# Altium schematic sheet BatteryController.SchDoc: Battery Management
size A3; ApprovedBy: Self; CheckedBy: Self; CompanyName: TAISAT; DrawnBy: Alperen FENERCİ; Organization: IKA; SheetNumber: 2; SheetTotal: 6
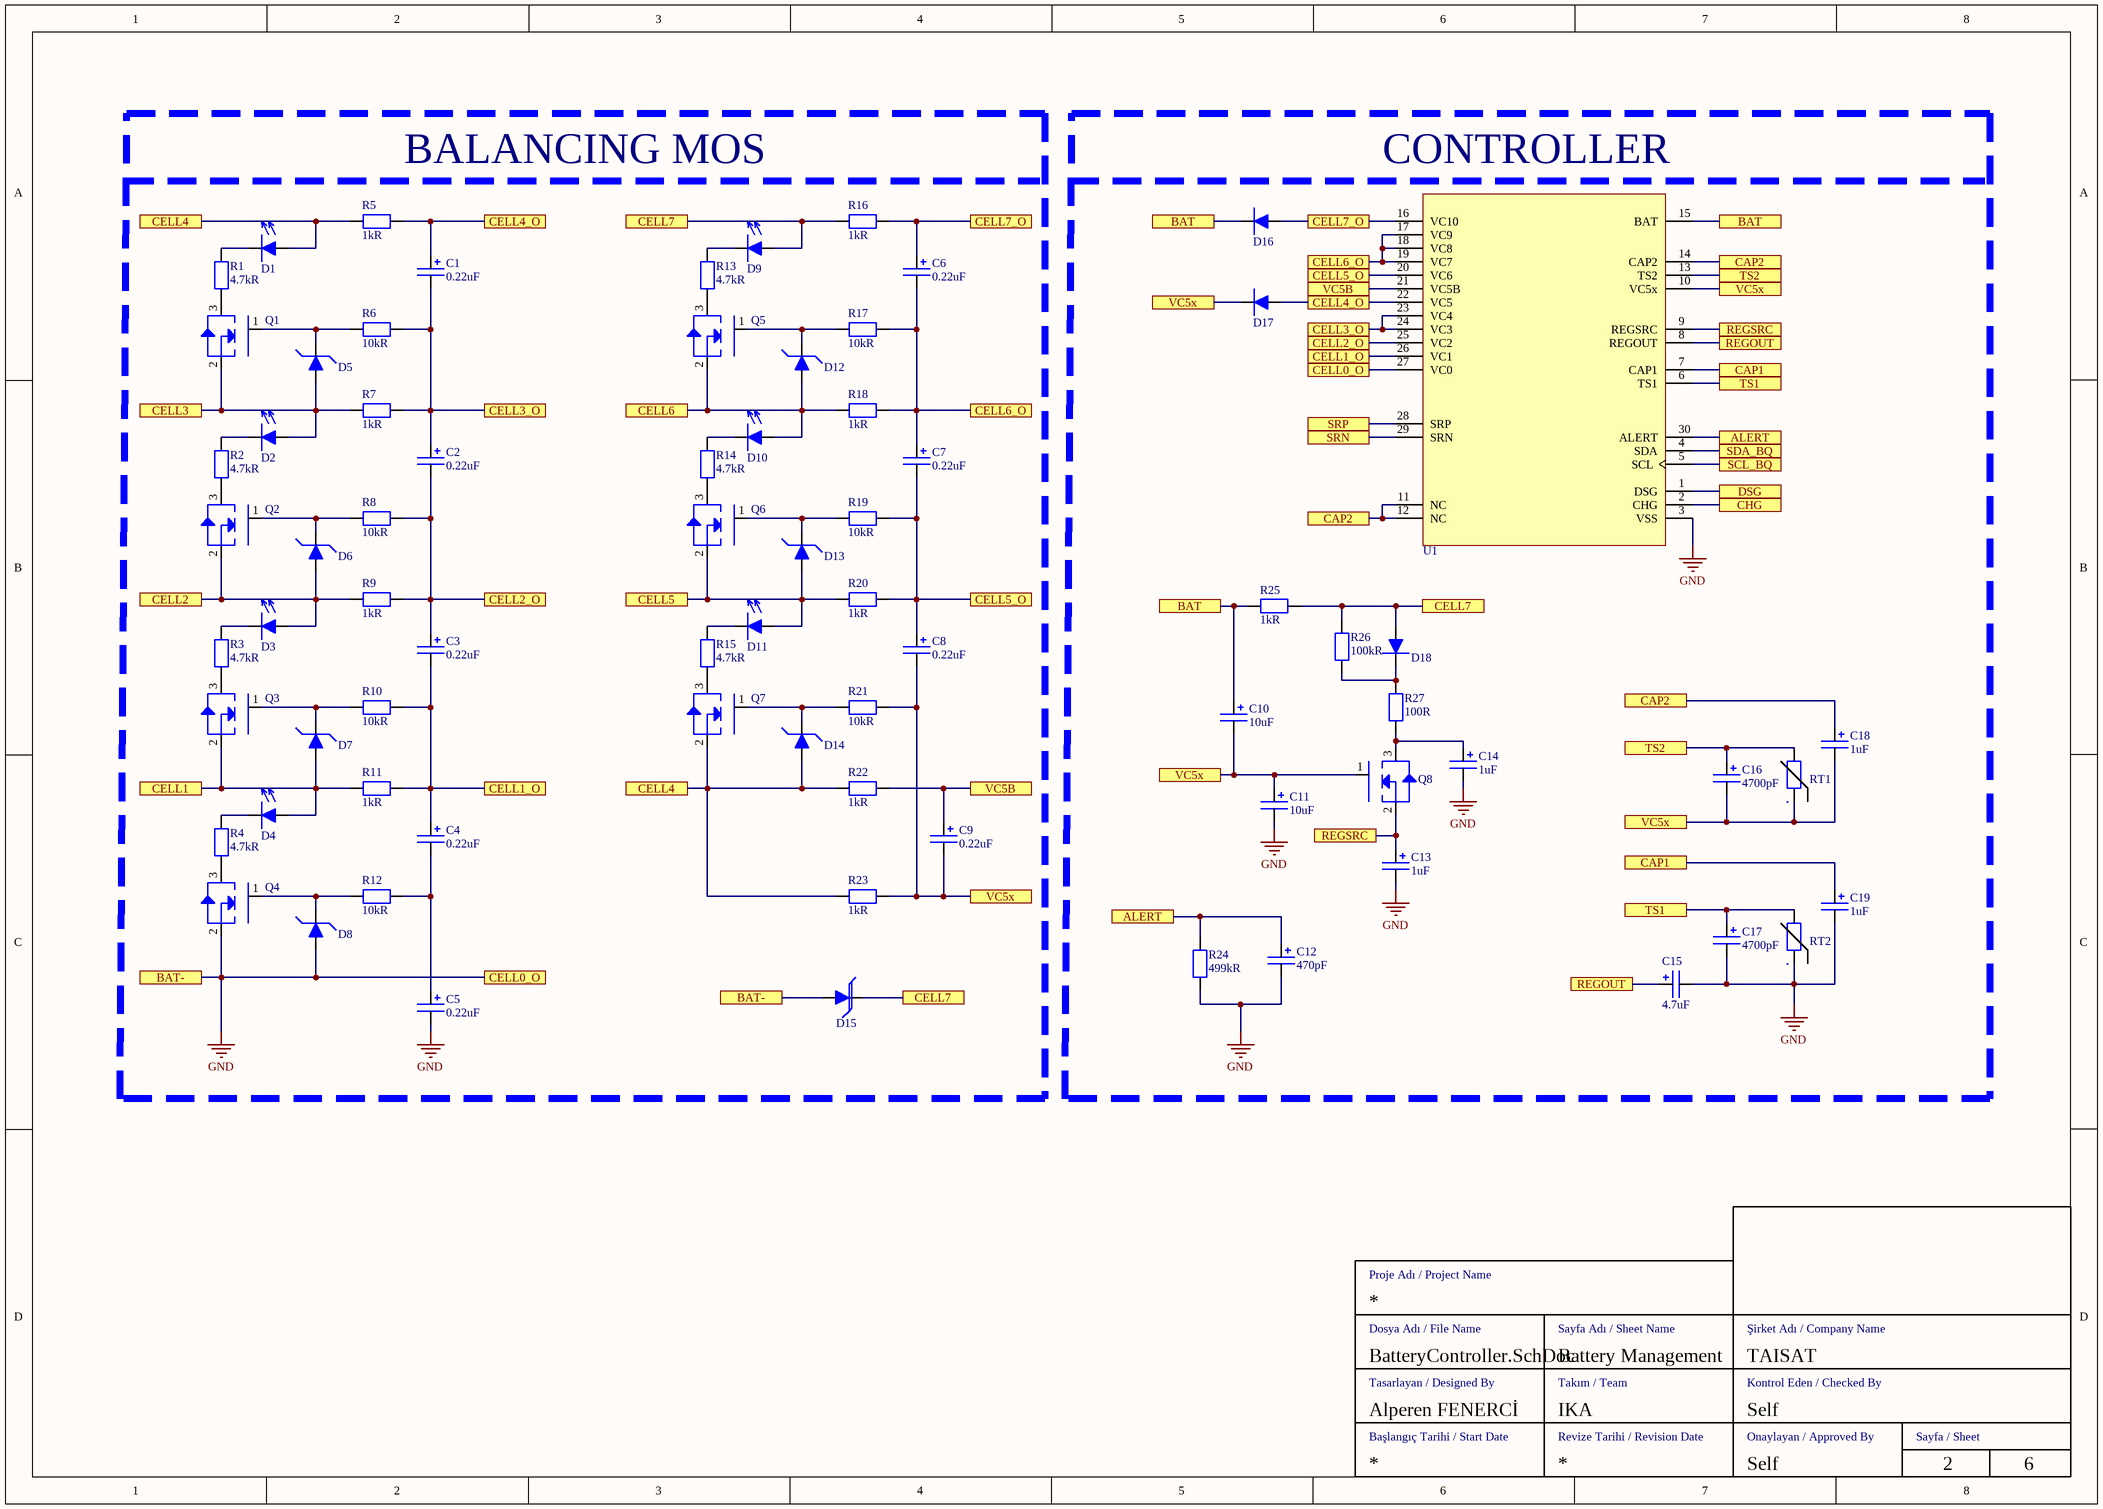
[diagram p0: BatteryController.SchDoc]

## Parts
C1  value 0.22uF  [CAP 0603]  (hidden comment: CAP 0603)
C2  value 0.22uF  [CAP 0603]  (hidden comment: CAP 0603)
C3  value 0.22uF  [CAP 0603]  (hidden comment: CAP 0603)
C4  value 0.22uF  [CAP 0603]  (hidden comment: CAP 0603)
C5  value 0.22uF  [CAP 0603]  (hidden comment: CAP 0603)
C6  value 0.22uF  [CAP 0603]  (hidden comment: CAP 0603)
C7  value 0.22uF  [CAP 0603]  (hidden comment: CAP 0603)
C8  value 0.22uF  [CAP 0603]  (hidden comment: CAP 0603)
C9  value 0.22uF  [CAP 0603]  (hidden comment: CAP 0603)
C10  value 10uF  [CAP 0603]  (hidden comment: CAP 0603)
C11  value 10uF  [CAP 0603]  (hidden comment: CAP 0603)
C12  value 470pF  [CAP 0603]  (hidden comment: CAP 0603)
C13  value 1uF  [CAP 0603]  (hidden comment: CAP 0603)
C14  value 1uF  [CAP 0603]  (hidden comment: CAP 0603)
C15  value 4.7uF  [CAP 0603]  (hidden comment: CAP 0603)
C16  value 4700pF  [CAP 0603]  (hidden comment: CAP 0603)
C17  value 4700pF  [CAP 0603]  (hidden comment: CAP 0603)
C18  value 1uF  [CAP 0603]  (hidden comment: CAP 0603)
C19  value 1uF  [CAP 0603]  (hidden comment: CAP 0603)
D1  LTW-C191TLA  [LED 0603]  (value not drawn)
D2  LTW-C191TLA  [LED 0603]  (value not drawn)
D3  LTW-C191TLA  [LED 0603]  (value not drawn)
D4  LTW-C191TLA  [LED 0603]  (value not drawn)
D5  MM3Z5V1T1G  [SOD323]  (value not drawn)
D6  MM3Z5V1T1G  [SOD323]  (value not drawn)
D7  MM3Z5V1T1G  [SOD323]  (value not drawn)
D8  MM3Z5V1T1G  [SOD323]  (value not drawn)
D9  LTW-C191TLA  [LED 0603]  (value not drawn)
D10  LTW-C191TLA  [LED 0603]  (value not drawn)
D11  LTW-C191TLA  [LED 0603]  (value not drawn)
D12  MM3Z5V1T1G  [SOD323]  (value not drawn)
D13  MM3Z5V1T1G  [SOD323]  (value not drawn)
D14  MM3Z5V1T1G  [SOD323]  (value not drawn)
D15  SMAJ36A-HT  [DO214AC]  (value not drawn)
D16  BAV20W-7-F  [SOD123]  (value not drawn)
D17  BAV20W-7-F  [SOD123]  (value not drawn)
D18  1N4148WS  [SOD323]  (value not drawn)
Q1  2N7002K  [SOT23-3]  (value not drawn)
Q2  2N7002K  [SOT23-3]  (value not drawn)
Q3  2N7002K  [SOT23-3]  (value not drawn)
Q4  2N7002K  [SOT23-3]  (value not drawn)
Q5  2N7002K  [SOT23-3]  (value not drawn)
Q6  2N7002K  [SOT23-3]  (value not drawn)
Q7  2N7002K  [SOT23-3]  (value not drawn)
Q8  2N7002K  [SOT23-3]  (value not drawn)
R1  value 4.7kR  [RESISTOR 1206]  (hidden comment: RES 1206)
R2  value 4.7kR  [RESISTOR 1206]  (hidden comment: RES 1206)
R3  value 4.7kR  [RESISTOR 1206]  (hidden comment: RES 1206)
R4  value 4.7kR  [RESISTOR 1206]  (hidden comment: RES 1206)
R5  value 1kR  [RESISTOR 0603]  (hidden comment: RES 0603)
R6  value 10kR  [RESISTOR 0603]  (hidden comment: RES 0603)
R7  value 1kR  [RESISTOR 0603]  (hidden comment: RES 0603)
R8  value 10kR  [RESISTOR 0603]  (hidden comment: RES 0603)
R9  value 1kR  [RESISTOR 0603]  (hidden comment: RES 0603)
R10  value 10kR  [RESISTOR 0603]  (hidden comment: RES 0603)
R11  value 1kR  [RESISTOR 0603]  (hidden comment: RES 0603)
R12  value 10kR  [RESISTOR 0603]  (hidden comment: RES 0603)
R13  value 4.7kR  [RESISTOR 1206]  (hidden comment: RES 1206)
R14  value 4.7kR  [RESISTOR 1206]  (hidden comment: RES 1206)
R15  value 4.7kR  [RESISTOR 1206]  (hidden comment: RES 1206)
R16  value 1kR  [RESISTOR 0603]  (hidden comment: RES 0603)
R17  value 10kR  [RESISTOR 0603]  (hidden comment: RES 0603)
R18  value 1kR  [RESISTOR 0603]  (hidden comment: RES 0603)
R19  value 10kR  [RESISTOR 0603]  (hidden comment: RES 0603)
R20  value 1kR  [RESISTOR 0603]  (hidden comment: RES 0603)
R21  value 10kR  [RESISTOR 0603]  (hidden comment: RES 0603)
R22  value 1kR  [RESISTOR 0603]  (hidden comment: RES 0603)
R23  value 1kR  [RESISTOR 0603]  (hidden comment: RES 0603)
R24  value 499kR  [RESISTOR 0603]  (hidden comment: RES 0603)
R25  value 1kR  [RESISTOR 0603]  (hidden comment: RES 0603)
R26  value 100kR  [RESISTOR 0603]  (hidden comment: RES 0603)
R27  value 100R  [RESISTOR 0603]  (hidden comment: RES 0603)
RT1  NTC 0603  [NTC 0603]  (value not drawn)
RT2  NTC 0603  [NTC 0603]  (value not drawn)
U1  BQ76930  [TSSOP-30]  (value not drawn)

## Blocks framed on the sheet
BALANCING MOS: C1-C9 D1-D15 Q1-Q7 R1-R23
CONTROLLER: C10-C19 D16-D18 Q8 R24-R27 RT1 RT2 U1

## Ports
ALERT, BAT, BAT-, CAP1, CAP2, CELL0_O, CELL1, CELL1_O, CELL2, CELL2_O, CELL3, CELL3_O, CELL4, CELL4_O, CELL5, CELL5_O, CELL6, CELL6_O, CELL7, CELL7_O, CHG, DSG, REGOUT, REGSRC, SCL_BQ, SDA_BQ, SRN, SRP, TS1, TS2, VC5B, VC5x

## Nets
GND: C5.2 C11.2 C12.2 C13.2 C14.2 C15.2 C17.2 C19.2 D8.2 D15.2 Q4.2(S) R24.1 RT2.1 U1.3(VSS) U1.27(VC0) ; port BAT-, port CELL0_O
ALERT: C12.1 R24.2 U1.30(ALERT) ; port ALERT
BAT: C10.1 D16.1 R25.2 U1.15(BAT) ; port BAT
CAP1: C19.1 U1.7(CAP1) ; port CAP1
CAP2: C18.1 U1.11(NC) U1.12(NC) U1.14(CAP2) ; port CAP2
CELL1: D4.2 D7.2 Q3.2(S) R11.2 ; port CELL1
CELL1_O: C3.2 C4.1 R10.1 R11.1 U1.26(VC1) ; port CELL1_O
CELL2: D3.2 D6.2 Q2.2(S) R9.2 ; port CELL2
CELL2_O: C2.2 C3.1 R8.1 R9.1 U1.25(VC2) ; port CELL2_O
CELL3: D2.2 D5.2 Q1.2(S) R7.2 ; port CELL3
CELL3_O: C1.2 C2.1 R6.1 R7.1 U1.23(VC4) U1.24(VC3) ; port CELL3_O
CELL4: D1.2 D14.2 Q7.2(S) R5.2 R22.2 R23.2 ; port CELL4
CELL4_O: C1.1 D17.2 R5.1 U1.22(VC5) ; port CELL4_O
CELL5: D11.2 D13.2 Q6.2(S) R20.2 ; port CELL5
CELL5_O: C7.2 C8.1 R19.1 R20.1 U1.20(VC6) ; port CELL5_O
CELL6: D10.2 D12.2 Q5.2(S) R18.2 ; port CELL6
CELL6_O: C6.2 C7.1 R17.1 R18.1 U1.17(VC9) U1.18(VC8) U1.19(VC7) ; port CELL6_O
CELL7: D9.2 D15.1 D18.2 R16.2 R25.1 R26.2 ; port CELL7
CELL7_O: C6.1 D16.2 R16.1 U1.16(VC10) ; port CELL7_O
CHG: U1.2(CHG) ; port CHG
DSG: U1.1(DSG) ; port DSG
REGOUT: C15.1 U1.8(REGOUT) ; port REGOUT
REGSRC: C13.1 Q8.2(S) U1.9(REGSRC) ; port REGSRC
SCL_BQ: U1.5(SCL) ; port SCL_BQ
SDA_BQ: U1.4(SDA) ; port SDA_BQ
SRN: U1.29(SRN) ; port SRN
SRP: U1.28(SRP) ; port SRP
TS1: C17.1 RT2.2 U1.6(TS1) ; port TS1
TS2: C16.1 RT1.2 U1.13(TS2) ; port TS2
VC5B: C9.1 R22.1 U1.21(VC5B) ; port VC5B
VC5x: C8.2 C9.2 C10.2 C11.1 C16.2 C18.2 D17.1 Q8.1(G) R21.1 R23.1 RT1.1 U1.10(VC5x) ; port VC5x
NetC4_2: C4.2 C5.1 R12.1
NetC14_1: C14.1 Q8.3(D) R27.1
NetD1_1: D1.1 R1.2
NetD2_1: D2.1 R2.2
NetD3_1: D3.1 R3.2
NetD4_1: D4.1 R4.2
NetD5_1: D5.1 Q1.1(G) R6.2
NetD6_1: D6.1 Q2.1(G) R8.2
NetD7_1: D7.1 Q3.1(G) R10.2
NetD8_1: D8.1 Q4.1(G) R12.2
NetD9_1: D9.1 R13.2
NetD10_1: D10.1 R14.2
NetD11_1: D11.1 R15.2
NetD12_1: D12.1 Q5.1(G) R17.2
NetD13_1: D13.1 Q6.1(G) R19.2
NetD14_1: D14.1 Q7.1(G) R21.2
NetD18_1: D18.1 R26.1 R27.2
NetQ1_3: Q1.3(D) R1.1
NetQ2_3: Q2.3(D) R2.1
NetQ3_3: Q3.3(D) R3.1
NetQ4_3: Q4.3(D) R4.1
NetQ5_3: Q5.3(D) R13.1
NetQ6_3: Q6.3(D) R14.1
NetQ7_3: Q7.3(D) R15.1

## Notes on the sheet
- Dosya Adı / File Name
- Proje Adı / Project Name
- Sayfa Adı / Sheet Name
- Şirket Adı / Company Name
- Tasarlayan / Designed By
- Takım / Team
- Kontrol Eden / Checked By
- Başlangıç Tarihi / Start Date
- Revize Tarihi / Revision Date
- Onaylayan / Approved By
- Sayfa / Sheet

## Library data of the parts
C1-C19 = CAP 0603: Multilayer Ceramic Capacitor; Capacitor Type: MLCC; Case/Package: 0603
D1-D4 D9-D11 = LED 0603: Chip LED; Case/Package: 0603
D5-D8 D12-D14 = MM3Z5V1T1G: Diode Zener; Voltage: 5.1V; Case/Package: SOD323; Diode Type: Zener; ComponentLink1Description: Ozdisan; ComponentLink1URL: https://ozdisan.com/power-semiconductors/diodes-diode-modules-and-rectifiers/zener-diodes/MM3Z5V1T1G/611730
D15 = SMAJ36A-HT: Diode TVS; Voltage: 36V; Diode Type: TVS; Case/Package: DO214
D16 D17 = BAV20W-7-F: Diode Switch; Voltage: 150V; Case/Package: SOD123; Diode Type: Switch
D18 = 1N4148WS: Diode Gen; Voltage: 75V; Diode Type: General; Case/Package: DO-41-2; ComponentLink1Description: Ozdisan; ComponentLink1URL: https://ozdisan.com/power-semiconductors/diodes-diode-modules-and-rectifiers/general-purpose-diodes/1N4148WS-HT/453557
Q1-Q8 = 2N7002K: MOSFET; Voltage: 60V; Current: 300mA; Transistor Type: N-CH; Case/Package: SOT23
R1-R4 R13-R15 = RES 1206: SMD Chip Resistor; Case/Package: 1206
R5-R12 R16-R27 = RES 0603: SMD Chip Resistor; Case/Package: 0603
RT1 RT2 = NTC 0603: Thermistor NTC; Value: 10kR; Case/Package: 0603
U1 = BQ76930: Cell Balance, Cell Monitoring; Category: PMIC; Case/Package: TSSOP